# Altium schematic sheet spine_0.SchDoc
size 434 x 356 mm; Origin: Eagle; OriginPath: \\wsl.localhost\Ubuntu-24.04\home\jverga\Helium_Electronics\SPIne-master\SPIne_V2\SPIne\spine.sch; OriginSheet: 1; OriginDescription: Leg COM
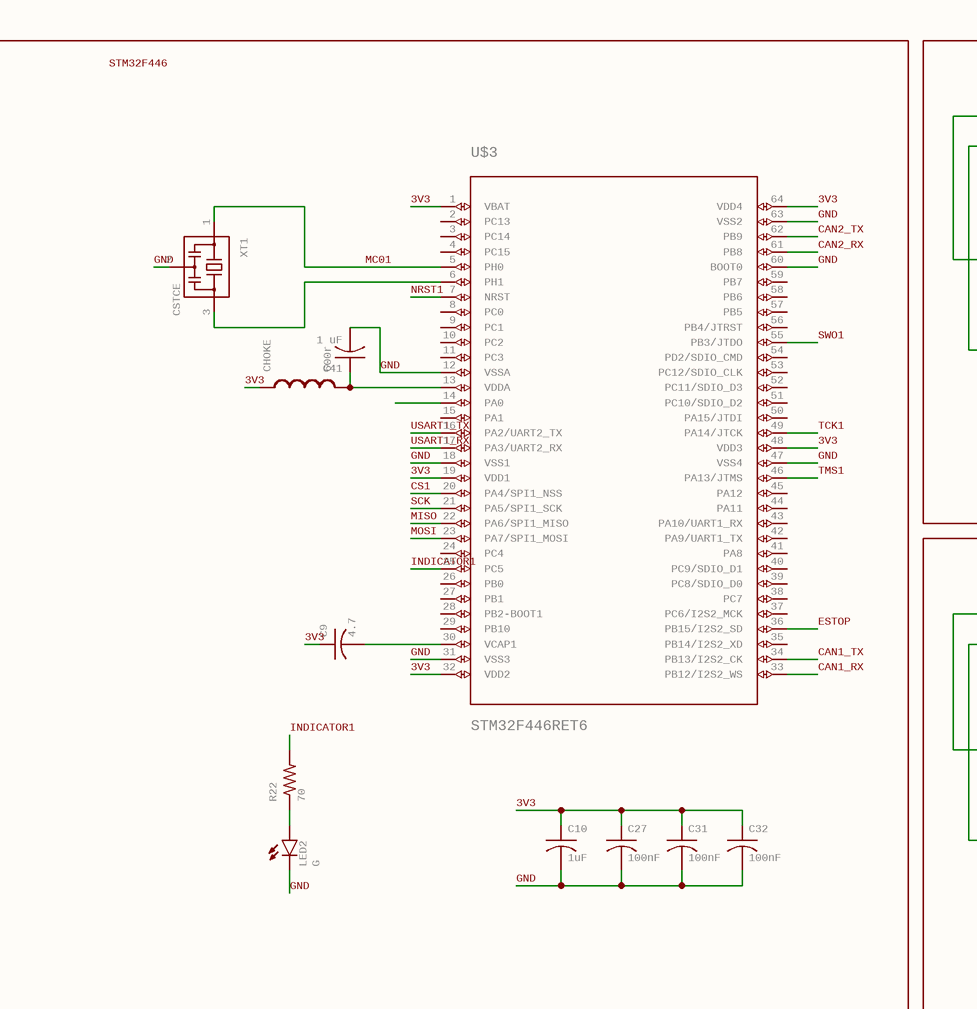
[diagram p0: spine_0.SchDoc, top left]
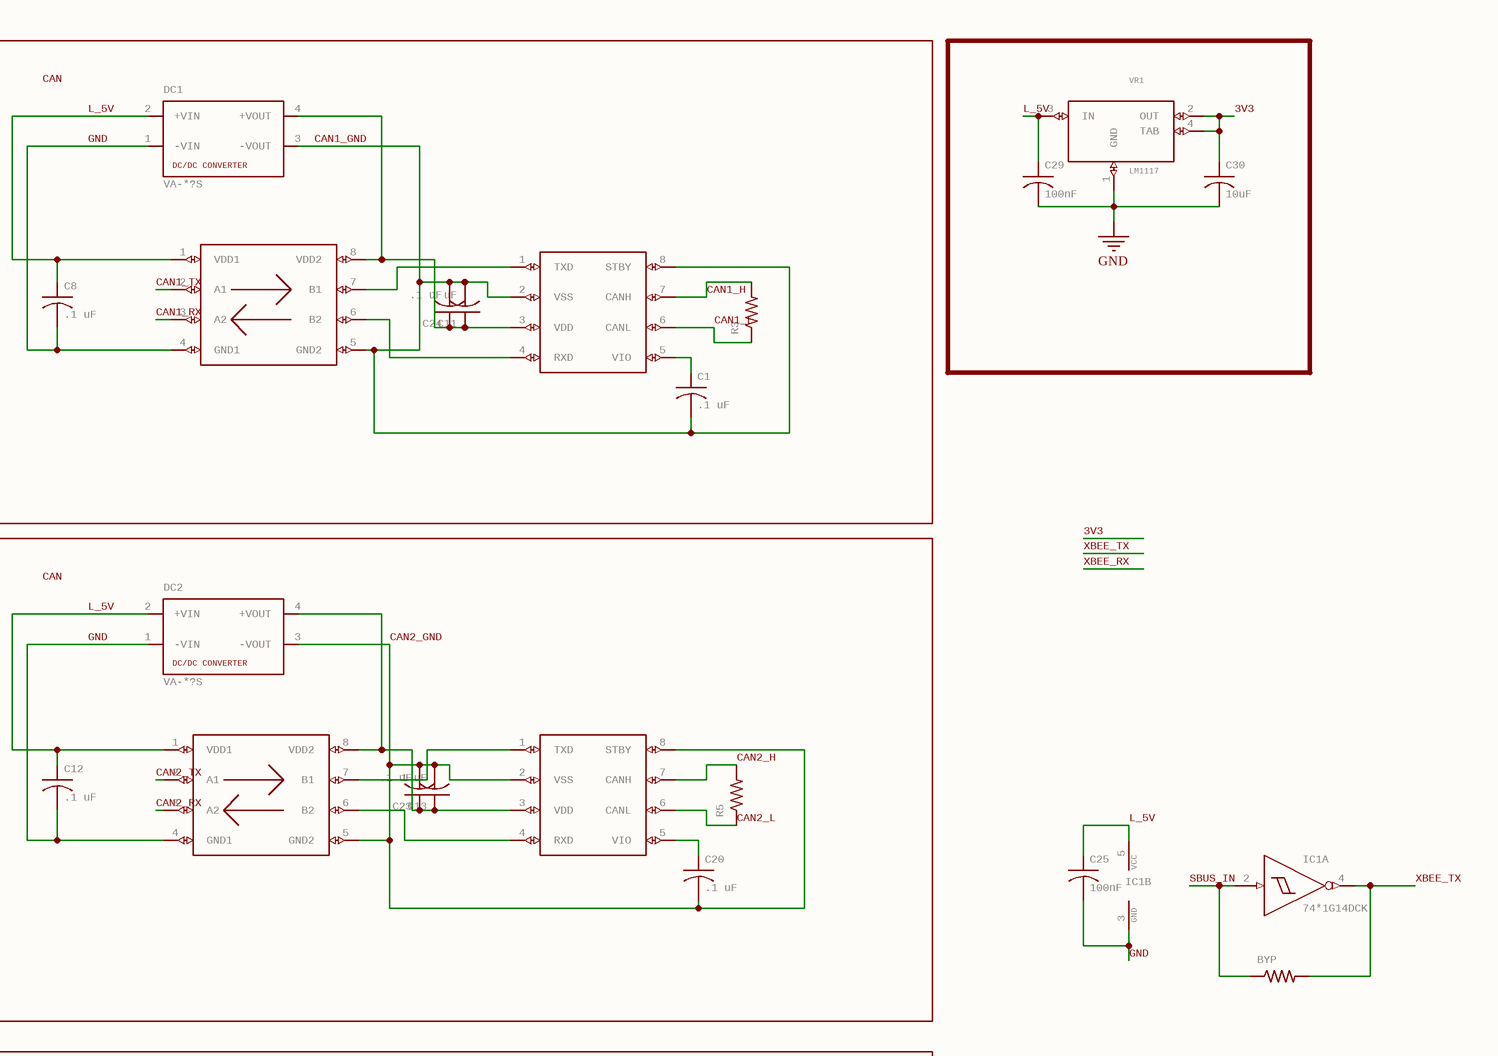
[diagram p1: spine_0.SchDoc, top right]
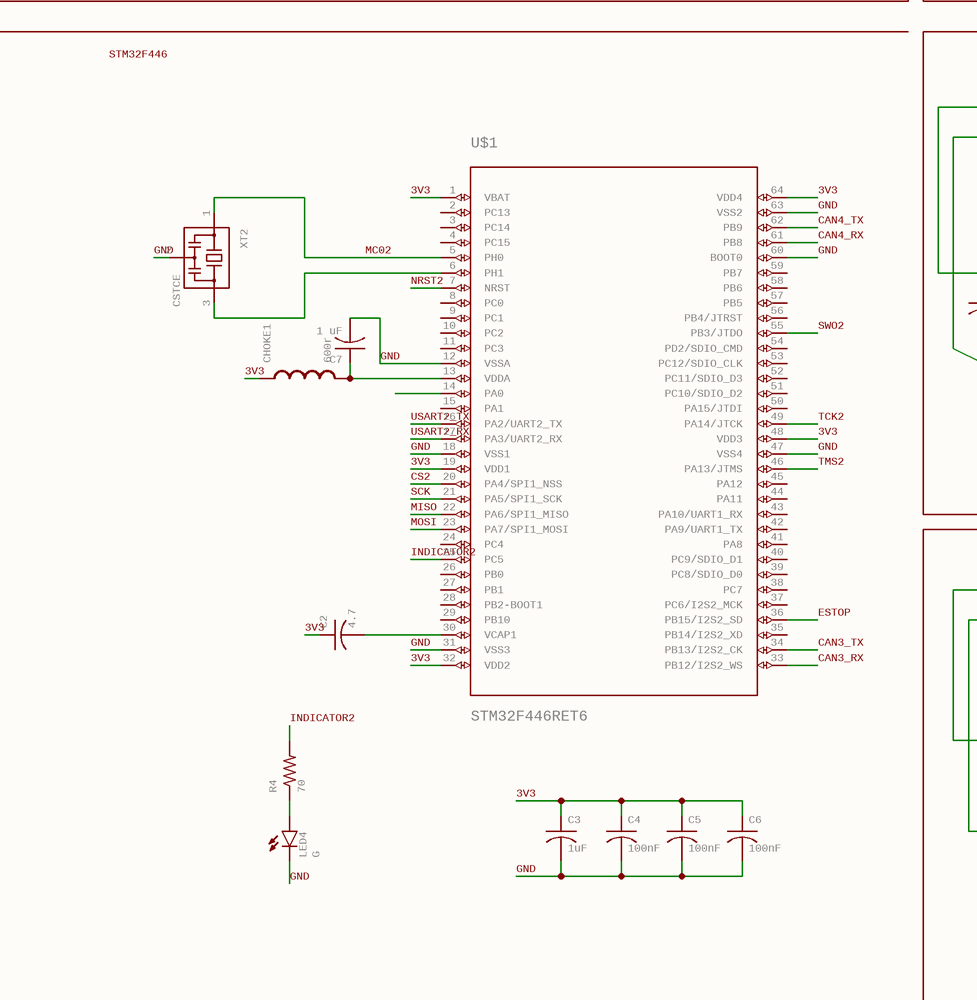
[diagram p2: spine_0.SchDoc, bottom left]
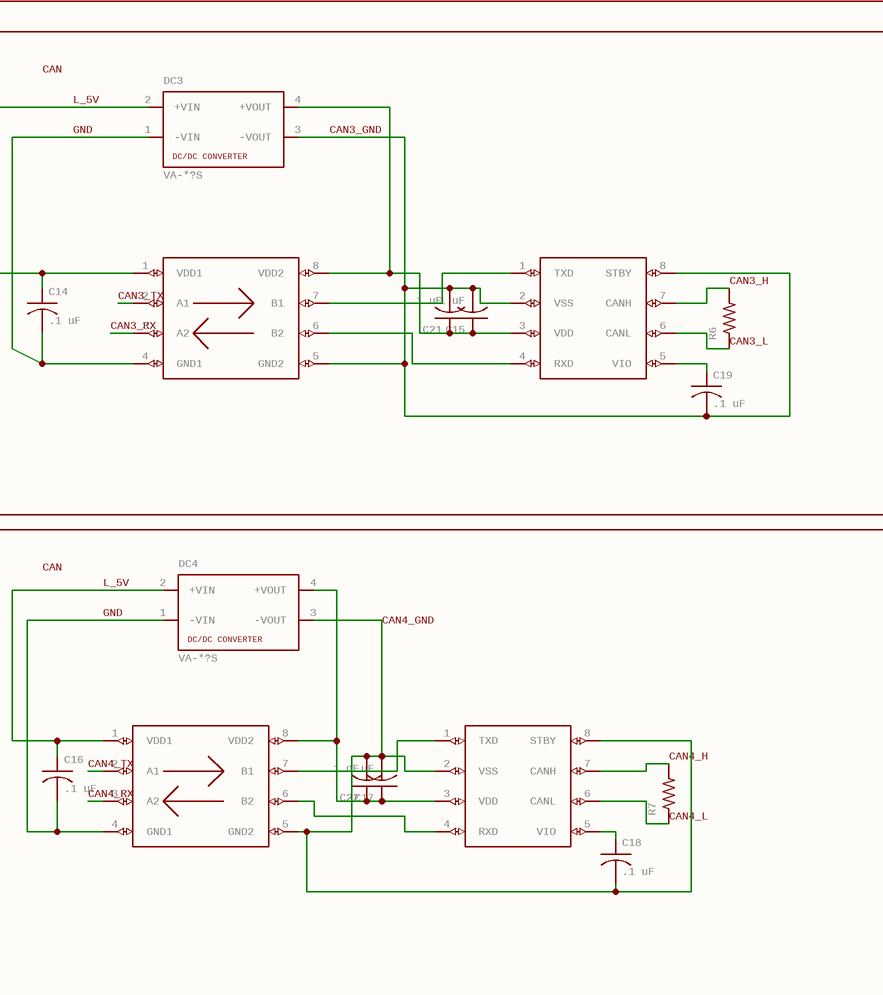
[diagram p3: spine_0.SchDoc, bottom right]

## Parts
BYP  R-US_R0402  [R0402]  (value not drawn)
C1  .1 uF  [C0603K]
C2  4.7  [C0603]
C3  1uF  [C0603]
C4  100nF  [C0603]
C5  100nF  [C0603]
C6  100nF  [C0603]
C7  1 uF  [C0603]
C8  .1 uF  [C0603K]
C9  4.7  [C0603]
C10  1uF  [C0603]
C11  1 uF  [C0603K]
C12  .1 uF  [C0603K]
C13  1 uF  [C0603K]
C14  .1 uF  [C0603K]
C15  1 uF  [C0603K]
C16  .1 uF  [C0603K]
C17  1 uF  [C0603K]
C18  .1 uF  [C0603K]
C19  .1 uF  [C0603K]
C20  .1 uF  [C0603K]
C21  .1 uF  [C0603K]
C22  .1 uF  [C0603K]
C23  .1 uF  [C0603K]
C24  .1 uF  [C0603K]
C25  100nF  [C0603]
C27  100nF  [C0603]
C29  100nF  [C0603]
C30  10uF  [C0805K]
C31  100nF  [C0603]
C32  100nF  [C0603]
C41  1 uF  [C0603]
CHOKE  600r  [0603]
CHOKE1  600r  [0603]
DC1  VA-*?S  DC/DCCONVERTER: DC/DC CONVERTER  [4SIL]
DC2  VA-*?S  DC/DCCONVERTER: DC/DC CONVERTER  [4SIL]
DC3  VA-*?S  DC/DCCONVERTER: DC/DC CONVERTER  [4SIL]
DC4  VA-*?S  DC/DCCONVERTER: DC/DC CONVERTER  [4SIL]
IC1  74*1G14DCK  [SC70-5]  (parts A,B of 2)
LED2  G  [LED-0603]
LED4  G  [LED-0603]
R3  R-US_R0402  [R0402]  (value not drawn)
R4  70  [R0603]
R5  R-US_R0402  [R0402]  (value not drawn)
R6  R-US_R0402  [R0402]  (value not drawn)
R7  R-US_R0402  [R0402]  (value not drawn)
R22  70  [R0603]
U$1  STM32F446RET6  [TQFP64]
U$3  STM32F446RET6  [TQFP64]
U$4  MCP2561  [SO08]  (value not drawn)
U$5  MCP2561  [SO08]  (value not drawn)
U$6  MCP2561  [SO08]  (value not drawn)
U$7  MCP2561  [SO08]  (value not drawn)
U$8  SI8410  [SO08]  (value not drawn)
U$9  SI8410  [SO08]  (value not drawn)
U$10  SI8410  [SO08]  (value not drawn)
U$11  SI8410  [SO08]  (value not drawn)
VR1  LM1117  [SOT-223]
XT1  CSTCE  [CSTCE]
XT2  CSTCE  [CSTCE]

## Blocks framed on the sheet
STM32F446: C9 C10 C27 C31 C32 C41 CHOKE LED2 R22 U$3 XT1
CAN: C1 C8 C11 C24 DC1 R3 U$4 U$8
CAN: C12 C13 C20 C23 DC2 R5 U$5 U$10
CAN: C14 C15 C19 C21 DC3 R6 U$6 U$9
CAN: C16-C18 C22 DC4 R7 U$7 U$11

## Nets
GND: C3.2 C4.2 C5.2 C6.2 C7.2 C8.2 C10.2 C12.2 C14.2 C16.2 C25.2 C27.2 C29.2 C30.2 C31.2 C32.2 C41.2 DC1.1(-VIN) DC2.1(-VIN) DC3.1(-VIN) DC4.1(-VIN) IC1.3(GND) LED2.C LED4.C U$1.12(VSSA) U$1.18(VSS1) U$1.31(VSS3) U$1.47(VSS4) U$1.60(BOOT0) U$1.63(VSS2) U$3.12(VSSA) U$3.18(VSS1) U$3.31(VSS3) U$3.47(VSS4) U$3.60(BOOT0) U$3.63(VSS2) U$8.4(GND1) U$9.4(GND1) U$10.4(GND1) U$11.4(GND1) VR1.1(GND) XT1.2 XT2.2
3V3: C2.1 C3.1 C4.1 C5.1 C6.1 C9.1 C10.1 C27.1 C30.1 C31.1 C32.1 CHOKE.1 CHOKE1.1 U$1.1(VBAT) U$1.19(VDD1) U$1.32(VDD2) U$1.48(VDD3) U$1.64(VDD4) U$3.1(VBAT) U$3.19(VDD1) U$3.32(VDD2) U$3.48(VDD3) U$3.64(VDD4) VR1.2(OUT) VR1.4(TAB)
CAN1_GND: C1.2 C11.2 C24.2 DC1.3(-VOUT) U$4.2(VSS) U$4.8(STBY) U$8.5(GND2)
CAN1_H: R3.2 U$4.7(CANH)
CAN1_L: R3.1 U$4.6(CANL)
CAN1_RX: U$3.33(PB12/I2S2_WS) U$8.3(A2)
CAN1_TX: U$3.34(PB13/I2S2_CK) U$8.2(A1)
CAN2_GND: C13.2 C20.2 C23.2 DC2.3(-VOUT) U$5.2(VSS) U$5.8(STBY) U$10.5(GND2)
CAN2_H: R5.2 U$5.7(CANH)
CAN2_L: R5.1 U$5.6(CANL)
CAN2_RX: U$3.61(PB8) U$10.3(A2)
CAN2_TX: U$3.62(PB9) U$10.2(A1)
CAN3_GND: C15.2 C19.2 C21.2 DC3.3(-VOUT) U$6.2(VSS) U$6.8(STBY) U$9.5(GND2)
CAN3_H: R6.2 U$6.7(CANH)
CAN3_L: R6.1 U$6.6(CANL)
CAN3_RX: U$1.33(PB12/I2S2_WS) U$9.3(A2)
CAN3_TX: U$1.34(PB13/I2S2_CK) U$9.2(A1)
CAN4_GND: C17.2 C18.2 C22.2 DC4.3(-VOUT) U$7.2(VSS) U$7.8(STBY) U$11.5(GND2)
CAN4_H: R7.2 U$7.7(CANH)
CAN4_L: R7.1 U$7.6(CANL)
CAN4_RX: U$1.61(PB8) U$11.3(A2)
CAN4_TX: U$1.62(PB9) U$11.2(A1)
CS1: U$3.20(PA4/SPI1_NSS)
CS2: U$1.20(PA4/SPI1_NSS)
ESTOP: U$1.36(PB15/I2S2_SD) U$3.36(PB15/I2S2_SD)
INDICATOR1: R22.2 U$3.25(PC5)
INDICATOR2: R4.2 U$1.25(PC5)
L_5V: C8.1 C12.1 C14.1 C16.1 C25.1 C29.1 DC1.2(+VIN) DC2.2(+VIN) DC3.2(+VIN) DC4.2(+VIN) IC1.5(VCC) U$8.1(VDD1) U$9.1(VDD1) U$10.1(VDD1) U$11.1(VDD1) VR1.3(IN)
MC01: U$3.5(PH0) XT1.1
MC02: U$1.5(PH0) XT2.1
MISO: U$1.22(PA6/SPI1_MISO) U$3.22(PA6/SPI1_MISO)
MOSI: U$1.23(PA7/SPI1_MOSI) U$3.23(PA7/SPI1_MOSI)
NRST1: U$3.7(NRST)
NRST2: U$1.7(NRST)
SBUS_IN: BYP.1 IC1.2(I)
SCK: U$1.21(PA5/SPI1_SCK) U$3.21(PA5/SPI1_SCK)
SWO1: U$3.55(PB3/JTDO)
SWO2: U$1.55(PB3/JTDO)
TCK1: U$3.49(PA14/JTCK)
TCK2: U$1.49(PA14/JTCK)
TMS1: U$3.46(PA13/JTMS)
TMS2: U$1.46(PA13/JTMS)
USART1_RX: U$3.17(PA3/UART2_RX)
USART1_TX: U$3.16(PA2/UART2_TX)
USART2_RX: U$1.17(PA3/UART2_RX)
USART2_TX: U$1.16(PA2/UART2_TX)
XBEE_TX: BYP.2 IC1.4(O)
NetC1_1: C1.1 U$4.5(VIO)
NetC2_2: C2.2 U$1.30(VCAP1)
NetC7_1: C7.1 CHOKE1.2 U$1.13(VDDA)
NetC9_2: C9.2 U$3.30(VCAP1)
NetC11_1: C11.1 C24.1 DC1.4(+VOUT) U$4.3(VDD) U$8.8(VDD2)
NetC13_1: C13.1 C23.1 DC2.4(+VOUT) U$5.3(VDD) U$10.8(VDD2)
NetC15_1: C15.1 C21.1 DC3.4(+VOUT) U$6.3(VDD) U$9.8(VDD2)
NetC17_1: C17.1 C22.1 DC4.4(+VOUT) U$7.3(VDD) U$11.8(VDD2)
NetC18_1: C18.1 U$7.5(VIO)
NetC19_1: C19.1 U$6.5(VIO)
NetC20_1: C20.1 U$5.5(VIO)
NetC41_1: C41.1 CHOKE.2 U$3.13(VDDA)
NetLED2_A: LED2.A R22.1
NetLED4_A: LED4.A R4.1
NetU$1_6: U$1.6(PH1) XT2.3
NetU$3_6: U$3.6(PH1) XT1.3
NetU$4_1: U$4.1(TXD) U$8.7(B1)
NetU$4_4: U$4.4(RXD) U$8.6(B2)
NetU$5_1: U$5.1(TXD) U$10.7(B1)
NetU$5_4: U$5.4(RXD) U$10.6(B2)
NetU$6_1: U$6.1(TXD) U$9.7(B1)
NetU$6_4: U$6.4(RXD) U$9.6(B2)
NetU$7_1: U$7.1(TXD) U$11.7(B1)
NetU$7_4: U$7.4(RXD) U$11.6(B2)

Not connected (* = marked no-connect by the designer): U$1 2(PC13) 3(PC14) 4(PC15) 8(PC0) 9(PC1) 10(PC2) 11(PC3) 14(PA0) 15(PA1) 24(PC4) 26(PB0) 27(PB1) 28(PB2-BOOT1) 29(PB10) 35(PB14/I2S2_XD) 37(PC6/I2S2_MCK) 38(PC7) 39(PC8/SDIO_D0) 40(PC9/SDIO_D1) 41(PA8) 42(PA9/UART1_TX) 43(PA10/UART1_RX) 44(PA11) 45(PA12) 50(PA15/JTDI) 51(PC10/SDIO_D2) 52(PC11/SDIO_D3) 53(PC12/SDIO_CLK) 54(PD2/SDIO_CMD) 56(PB4/JTRST) 57(PB5) 58(PB6) 59(PB7); U$3 2(PC13) 3(PC14) 4(PC15) 8(PC0) 9(PC1) 10(PC2) 11(PC3) 14(PA0) 15(PA1) 24(PC4) 26(PB0) 27(PB1) 28(PB2-BOOT1) 29(PB10) 35(PB14/I2S2_XD) 37(PC6/I2S2_MCK) 38(PC7) 39(PC8/SDIO_D0) 40(PC9/SDIO_D1) 41(PA8) 42(PA9/UART1_TX) 43(PA10/UART1_RX) 44(PA11) 45(PA12) 50(PA15/JTDI) 51(PC10/SDIO_D2) 52(PC11/SDIO_D3) 53(PC12/SDIO_CLK) 54(PD2/SDIO_CMD) 56(PB4/JTRST) 57(PB5) 58(PB6) 59(PB7)

## Notes on the sheet
- STM32F446

## Library data of the parts
BYP R3 R5-R7 = R-US_R0402: RESISTOR, American symbol; GateName_1: G$1; SymbolName_1: R-US; DeviceSetName: R-US_; DeviceName: R0402; LibraryName: rcl
C1 C8 C11-C24 = C-USC0603K: CAPACITOR, American symbol; GateName_1: G$1; SymbolName_1: C-US; DeviceName: C0603K; LibraryName: rcl; DeviceSetName: C-US
C2-C7 C9 C10 C25 C27 C29 C31 C32 C41 = C-USC0603: CAPACITOR, American symbol; GateName_1: G$1; SymbolName_1: C-US; DeviceName: C0603; LibraryName: rcl; DeviceSetName: C-US
C30 = C-USC0805K: CAPACITOR, American symbol; GateName_1: G$1; SymbolName_1: C-US; DeviceName: C0805K; LibraryName: rcl; DeviceSetName: C-US
CHOKE CHOKE1 = INDUCTOR0603: Inductors   Basic Inductor/Choke - 0603 and 1206. Footprints are not proven and vary greatly between part numbers. INDUCTOR POWER 3.3UH 4.0A SMD 0.197" L x 0.197" W x 0.177" H (5.00mm x 5.00mm x 4.50mm); GateName_1: G$1; SymbolName_1: INDUCTOR; DeviceName: 0603; LibraryName: SparkFun-Passives; DeviceSetName: INDUCTOR
DC1-DC4 = VA-*?S: DC DC Converter Single Output, 1 Watt   Motien Technology Co.,Ltd. Source:  Data sheet; GateName_1: G$1; SymbolName_1: DC+; DeviceName: S; DeviceSetName: VA-*?; LibraryName: dc-dc-converter; MF: MF; MPN: MPN; OC_FARNELL: unknown; OC_NEWARK: unknown
IC1 = 74*1G14DCK: Single Schmitt-Trigger Inverter Gate; GateName_1: A; SymbolName_1: 7414; GateName_2: P; SymbolName_2: PWRN; DeviceName: DCK; LibraryName: 74xx-little-us; DeviceSetName: 74*1G14
LED2 LED4 = LED0603: LEDsStandard schematic elements and footprints for 5mm, 3mm, 1206, and 0603 sized LEDs. 5mm - Spark Fun Electronics SKU : COM-00529 (and others); GateName_1: G$1; SymbolName_1: LED; DeviceName: 0603; LibraryName: SparkFun-LED; DeviceSetName: LED
R4 R22 = R-US_R0603: RESISTOR, American symbol; GateName_1: G$1; SymbolName_1: R-US; DeviceSetName: R-US_; DeviceName: R0603; LibraryName: rcl
U$1 U$3 = STM32F446RET6: ARM DSP Chip used on the WAV Trigger board.; GateName_1: G$1; SymbolName_1: STM32F405RG; LibraryName: BenLibrary; DeviceSetName: STM32F446RET6
U$4-U$7 = MCP2561: GateName_1: G$1; SymbolName_1: MCP2562; LibraryName: BenLibrary; DeviceSetName: MCP2561
U$8-U$11 = SI8410: GateName_1: G$1; SymbolName_1: SI8410; LibraryName: BenLibrary; DeviceSetName: SI8410
VR1 = LM1117: GateName_1: G$1; SymbolName_1: LM1117; LibraryName: sc_usercreated; DeviceSetName: LM1117
XT1 XT2 = CSTCE: GateName_1: G$1; SymbolName_1: CST; LibraryName: sc_usercreated; DeviceSetName: CSTCE